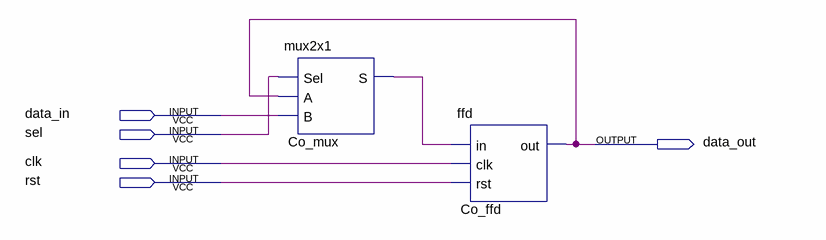
[diagram p0: schematic sheet]
// Quartus schematic regbase.bdf as structural Verilog: 2 symbols, 5 pins
module regbase (
  input  data_in,
  input  sel,
  input  clk,
  input  rst,
  output data_out
);

  wire Co_mux_s;

  mux2x1 Co_mux (.Sel(sel), .A(data_out), .B(data_in), .S(Co_mux_s));
  ffd Co_ffd (.in(Co_mux_s), .clk(clk), .rst(rst), .out(data_out));
endmodule
